# Altium schematic sheet V1.0.SchDoc
size 152 x 101 mm
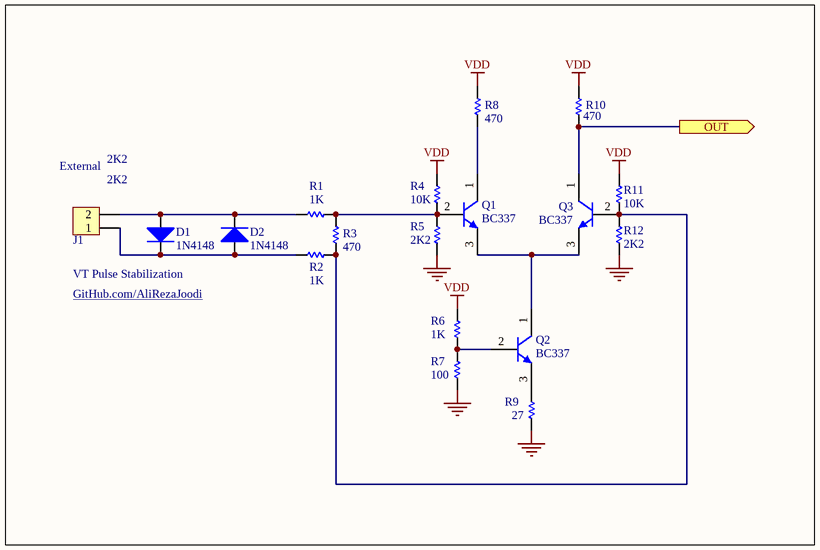
[diagram p0: V1.0.SchDoc]

## Parts
D1  1N4148  [D_THD_AXIAL0.3_DO-35]
D2  1N4148  [D_THD_AXIAL0.3_DO-35]
J1  2PIN  [Connector_Phoenix_2PIN_MSTB]  (value not drawn)
Q1  BC337  [TO92_3Pin_Form3]
Q2  BC337  [TO92_3Pin_Form3]
Q3  BC337  [TO92_3Pin_Form3]
R1  1K  [R_THD_AXIAL0.4(1/4W)]
R2  1K  [R_THD_AXIAL0.4(1/4W)]
R3  470  [R_THD_AXIAL0.4(1/4W)]
R4  10K  [R_THD_AXIAL0.4(1/4W)]
R5  2K2  [R_THD_AXIAL0.4(1/4W)]
R6  1K  [R_THD_AXIAL0.4(1/4W)]
R7  100  [R_THD_AXIAL0.4(1/4W)]
R8  470  [R_THD_AXIAL0.4(1/4W)]
R9  27  [R_THD_AXIAL0.4(1/4W)]
R10  470  [R_THD_AXIAL0.4(1/4W)]
R11  10K  [R_THD_AXIAL0.4(1/4W)]
R12  2K2  [R_THD_AXIAL0.4(1/4W)]

## Ports
OUT (out)

## Nets
GND: R5.1 R7.1 R9.1 R12.1
VDD: R4.2 R6.2 R8.2 R10.2 R11.2
OUT: Q3.1(C) R10.1 ; port OUT
NetD1_1: D1.1(A) D2.2(K) J1.2 R1.2
NetD1_2: D1.2(K) D2.1(A) J1.1 R2.2
NetQ1_1: Q1.1(C) R8.1
NetQ1_2: Q1.2(B) R1.1 R3.1 R4.1 R5.2
NetQ1_3: Q1.3(E) Q2.1(C) Q3.3(E)
NetQ2_2: Q2.2(B) R6.1 R7.2
NetQ2_3: Q2.3(E) R9.2
NetQ3_2: Q3.2(B) R2.1 R3.2 R11.1 R12.2

## Notes on the sheet
- (near J1) External
- 2K2
- (near J1) 2K2
- GitHub.com/AliRezaJoodi
- VT Pulse Stabilization

## Library data of the parts
D1 D2 = Diode: Diode,; Revision: July-2002: Re-released for DXP Platform.
J1 = Connector_Header_2Pin: Connector, Header, 2Pin; Revision: July-2002: Re-released for DXP Platform.
Q1-Q3 = Transistor_BJT_NPN: Transistor, BJT, NPN; Package Reference: TO-92A
R1-R12 = Resistor: Resistor,; Revision: July-2002: Re-released for DXP Platform.